# EAGLE design myradio (EAGLE 5.10)
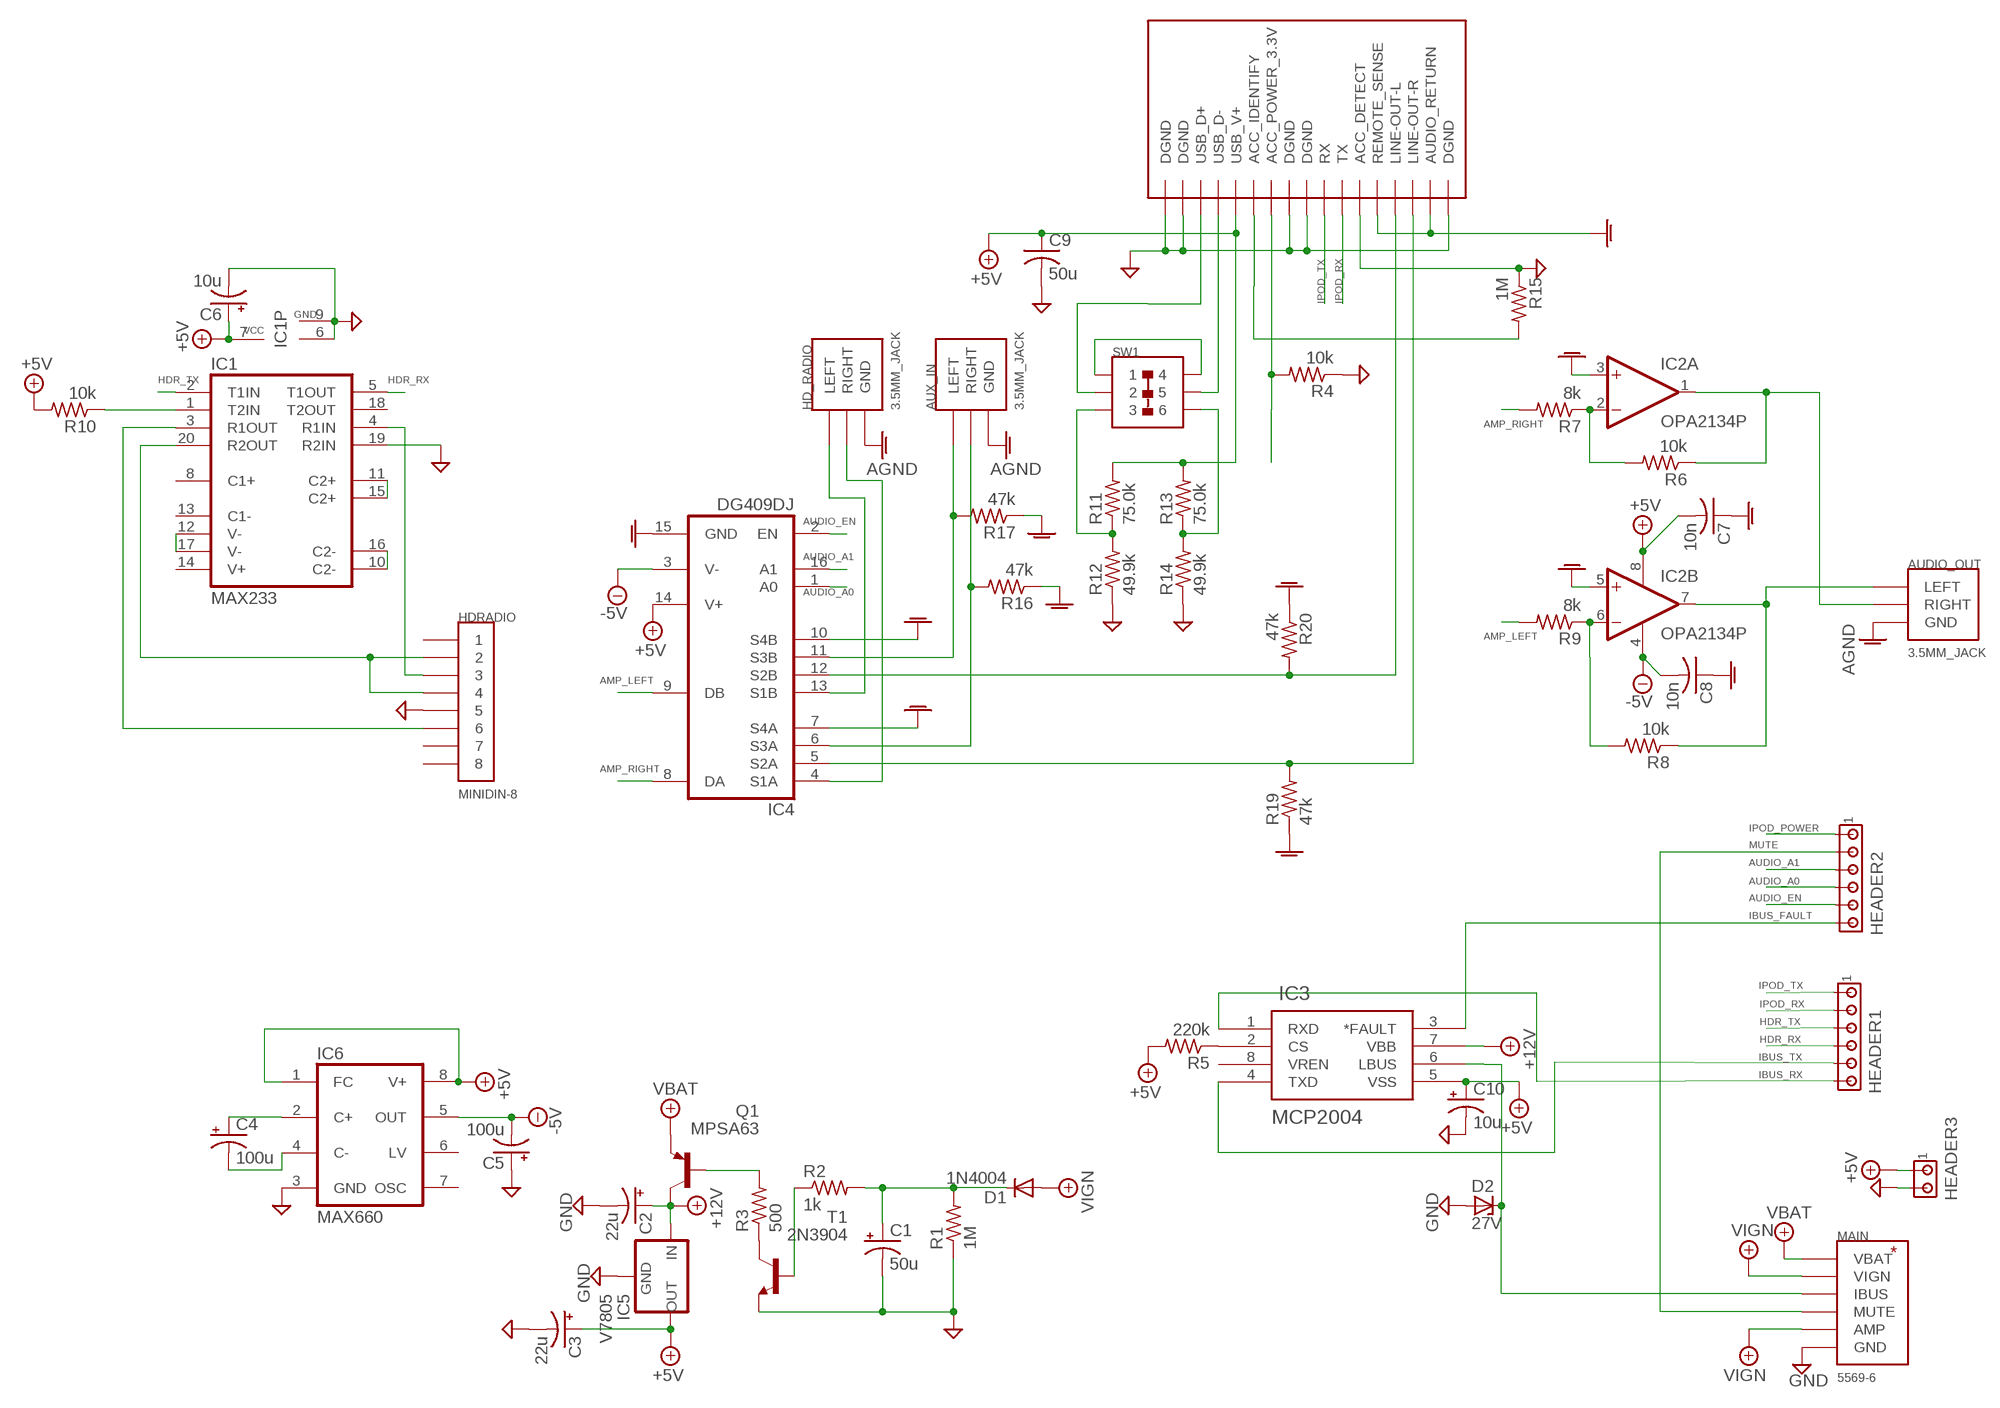
[diagram p0: schematic, sheet 1]

## Parts
AUDIO_OUT  3.5MM_JACK  [3.5MM_JACK]
AUX_IN  3.5MM_JACK  [3.5MM_JACK]
C1  50u  CPOL-USE2-5  [E2-5]
C2  22u  CPOL-USE2-5  [E2-5]
C3  22u  CPOL-USE2-5  [E2-5]
C4  100u  CPOL-USE2-5  [E2-5]
C5  100u  CPOL-USE2-5  [E2-5]
C6  10u  CPOL-USE2-5  [E2-5]
C7  10n  C-US025-050X050  [C025-050X050]
C8  10n  C-US025-050X050  [C025-050X050]
C9  50u  C-US025-050X050  [C025-050X050]
C10  10u  CPOL-USE2-5  [E2-5]
CON1  IPOD_CONNECTOR  [IPOD_EDGE_BIGPAD]
D1  1N4004  [DO41-10]
D2  27V  ZENER-DIODEZD-10  [ZDIO-10]
HD_RADIO  3.5MM_JACK  [3.5MM_JACK]
HDRADIO  MINIDIN-8  [MINIDIN-8]
HEADER1  MTA06-100  [10X06MTA]
HEADER2  MTA06-100  [10X06MTA]
HEADER3  MTA02-100  [10X02MTA]
IC1  MAX233  [DIL20]
IC2  OPA2134P  [DIL08]
IC3  MCP2004  [SOCKET-08]
IC4  DG409DJ  [DIL16]
IC5  V7805  V7805-1000R  [78XXL]
IC6  MAX660  MAX660CPA  [DIL08]
MAIN  5569-6  [5569-6]
Q1  MPSA63  [TO92-CBE]
R1  1M  R-US_0207/10  [0207/10]
R2  1k  R-US_0207/10  [0207/10]
R3  500  R-US_0207/10  [0207/10]
R4  10k  R-US_0207/10  [0207/10]
R5  220k  R-US_0207/10  [0207/10]
R6  10k  R-US_0207/10  [0207/10]
R7  8k  R-US_0207/10  [0207/10]
R8  10k  R-US_0207/10  [0207/10]
R9  8k  R-US_0207/10  [0207/10]
R10  10k  R-US_0207/10  [0207/10]
R11  75.0k  R-US_0207/10  [0207/10]
R12  49.9k  R-US_0207/10  [0207/10]
R13  75.0k  R-US_0207/10  [0207/10]
R14  49.9k  R-US_0207/10  [0207/10]
R15  1M  R-US_0207/10  [0207/10]
R16  47k  R-US_0207/10  [0207/10]
R17  47k  R-US_0207/10  [0207/10]
R19  47k  R-US_0207/10  [0207/10]
R20  47k  R-US_0207/10  [0207/10]
SW1  DPDT-SWITCH  [DPDT-SWITCH]
T1  2N3904  2N3904-NPN-TO92-EBC  [TO92-EBC]

## Nets
+5V [power]: C3.+ C6.+ C7.2 C9.1 C10.+ CON1.P$8(USB_V+) HEADER3.1 IC1.7(VCC) IC2.8(P:V+) IC3.5(VSS) IC4.14(V+) IC5.OUT IC6.1(FC) IC6.8(V+) R5.2 R10.2 R11.2 R13.2
+12V [power]: C2.+ IC3.7(VBB) IC5.IN Q1.C
-5V [power]: C5.- C8.2 IC2.4(P:V-) IC4.3(V-) IC6.5(OUT)
AGND: AUDIO_OUT.1(GND) AUX_IN.1(GND) C7.1 C8.1 CON1.P$24(REMOTE_SENSE) CON1.P$29(AUDIO_RETURN) HD_RADIO.1(GND) IC2.3(A:+IN) IC2.5(B:+IN) IC4.7(S4A) IC4.10(S4B) IC4.15(GND) R16.1 R17.1 R19.1 R20.1
AMP_LEFT: IC4.9(DB) R9.2
AMP_RIGHT: IC4.8(DA) R7.2
AUDIO_A0: HEADER2.3 IC4.1(A0)
AUDIO_A1: HEADER2.4 IC4.16(A1)
AUDIO_EN: HEADER2.2 IC4.2(EN)
AUDIO_OUT_L: AUDIO_OUT.2(LEFT) IC2.7(B:OUT) R8.1
AUDIO_OUT_R: AUDIO_OUT.3(RIGHT) IC2.1(A:OUT) R6.1
AUX_LEFT: AUX_IN.2(LEFT) IC4.11(S3B) R17.2
AUX_RIGHT: AUX_IN.3(RIGHT) IC4.6(S3A) R16.2
GND [power]: C1.- C2.- C3.- C5.+ C6.- C9.2 C10.- CON1.P$1(DGND) CON1.P$2(DGND) CON1.P$15(DGND) CON1.P$16(DGND) CON1.P$20(ACC_DETECT) CON1.P$30(DGND) D2.A HDRADIO.5 HEADER3.2 IC1.6(GND) IC1.9(GND) IC1.19(R2IN) IC5.GND IC6.3(GND) MAIN.6(GND) R1.1 R4.1 R12.1 R14.1 R15.1 T1.E
HDR_LEFT: HD_RADIO.2(LEFT) IC4.13(S1B)
HDR_RIGHT: HD_RADIO.3(RIGHT) IC4.4(S1A)
HDR_RX: HEADER1.3 IC1.5(T1OUT)
HDR_TX: HEADER1.4 IC1.2(T1IN)
IBUS: D2.C IC3.6(LBUS) MAIN.3(IBUS)
IBUS_FAULT: HEADER2.1 IC3.3(*FAULT)
IBUS_RX: HEADER1.1 IC3.1(RXD)
IBUS_TX: HEADER1.2 IC3.4(TXD)
IPOD_LEFT: CON1.P$27(LINE-OUT-L) IC4.12(S2B) R20.2
IPOD_POWER: CON1.P$13(ACC_POWER_3.3V) HEADER2.6 R4.2
IPOD_RIGHT: CON1.P$28(LINE-OUT-R) IC4.5(S2A) R19.2
IPOD_RX: CON1.P$19(TX) HEADER1.5
IPOD_TX: CON1.P$18(RX) HEADER1.6
MUTE: HEADER2.5 MAIN.4(MUTE)
N$2: HDRADIO.6 IC1.3(R1OUT)
N$3: C1.+ D1.C R1.2 R2.2
N$4: R2.1 T1.B
N$5: Q1.B R3.2
N$6: R3.1 T1.C
N$12: C4.+ IC6.2(C+)
N$13: IC2.2(A:-IN) R6.2 R7.1
N$14: C4.- IC6.4(C-)
N$16: HDRADIO.3 IC1.4(R1IN)
N$18: HDRADIO.2 HDRADIO.4 IC1.20(R2OUT)
N$19: IC1.12(V-) IC1.17(V-)
N$20: IC1.10(C2-) IC1.16(C2-)
N$21: IC1.11(C2+) IC1.15(C2+)
N$22: IC3.2(CS) R5.1
N$23: IC2.6(B:-IN) R8.2 R9.1
N$24: IC1.1(T2IN) R10.1
N$26: R11.1 R12.2 SW1.3
N$27: CON1.P$10(ACC_IDENTIFY) R15.2
N$29: CON1.P$4(USB_D+) SW1.2
N$31: CON1.P$6(USB_D-) SW1.5
N$32: SW1.1 SW1.4
N$33: R13.1 R14.2 SW1.6
VBAT [power]: MAIN.1(VBAT) Q1.E
VIGN: D1.A MAIN.2(VIGN) MAIN.5(AMP)
Unconnected: HDRADIO.1 HDRADIO.7 HDRADIO.8 IC1.8(C1+) IC1.13(C1-) IC1.14(V+) IC1.18(T2OUT) IC3.8(VREN) IC6.6(LV) IC6.7(OSC)

## Library data of the parts
AUDIO_OUT AUX_IN HD_RADIO = myradio:3.5MM_JACK: 3.5mm Audio Jack STX-3150-3N
C1-C6 C10 = rcl:CPOL-US: POLARIZED CAPACITOR, American symbol
C7-C9 = rcl:C-US: CAPACITOR, American symbol
CON1 = myradio:IPOD_CONNECTOR: male ipod edge connector from Ridax
D1 = diode:1N4004: DIODE general purpose rectifier, 1 A
D2 = diode:ZENER-DIODE: Z-Diode
HDRADIO = myradio:MINIDIN-8: MINI-DIN 8 Pin Connector KMDLX-8S-BS
HEADER1 HEADER2 = con-amp:MTA06-100: AMP connector
HEADER3 = con-amp:MTA02-100: AMP connector
IC1 = maxim:MAX233: RS232 TRANSEIVER
IC2 = linear:OPA2134: SoundPLUS (TM) High Performance AUDIO OPERATIONAL AMPLIFIERS Source: http://focus.ti.com/lit/ds/sbos058/sbos058.pdf
IC3 = myradio:MCP2004: LIN Bus Transceiver
IC4 = maxim:DG409DJ: ANALOG MULTIPLEXER
IC5 = myradio:V7805-1000R: Switched 5V Regulator
IC6 = maxim:MAX660CPA: Charge-pump VOLTAGE CONVERTER
MAIN = myradio:5569-6: Main Board I/O Connector Molex 5569-6
Q1 = transistor-pnp:MPSA63*: PNP Transistror
R1-R17 R19 R20 = rcl:R-US_: RESISTOR, American symbol
SW1 = myradio:DPDT-SWITCH: mini DPDT slide switch CKN9545-ND
T1 = transistor-neu-to92:*-NPN-: NPN Transistror

## Net classes
1 power: width 0.508 mm, clearance 0.254 mm

## Board
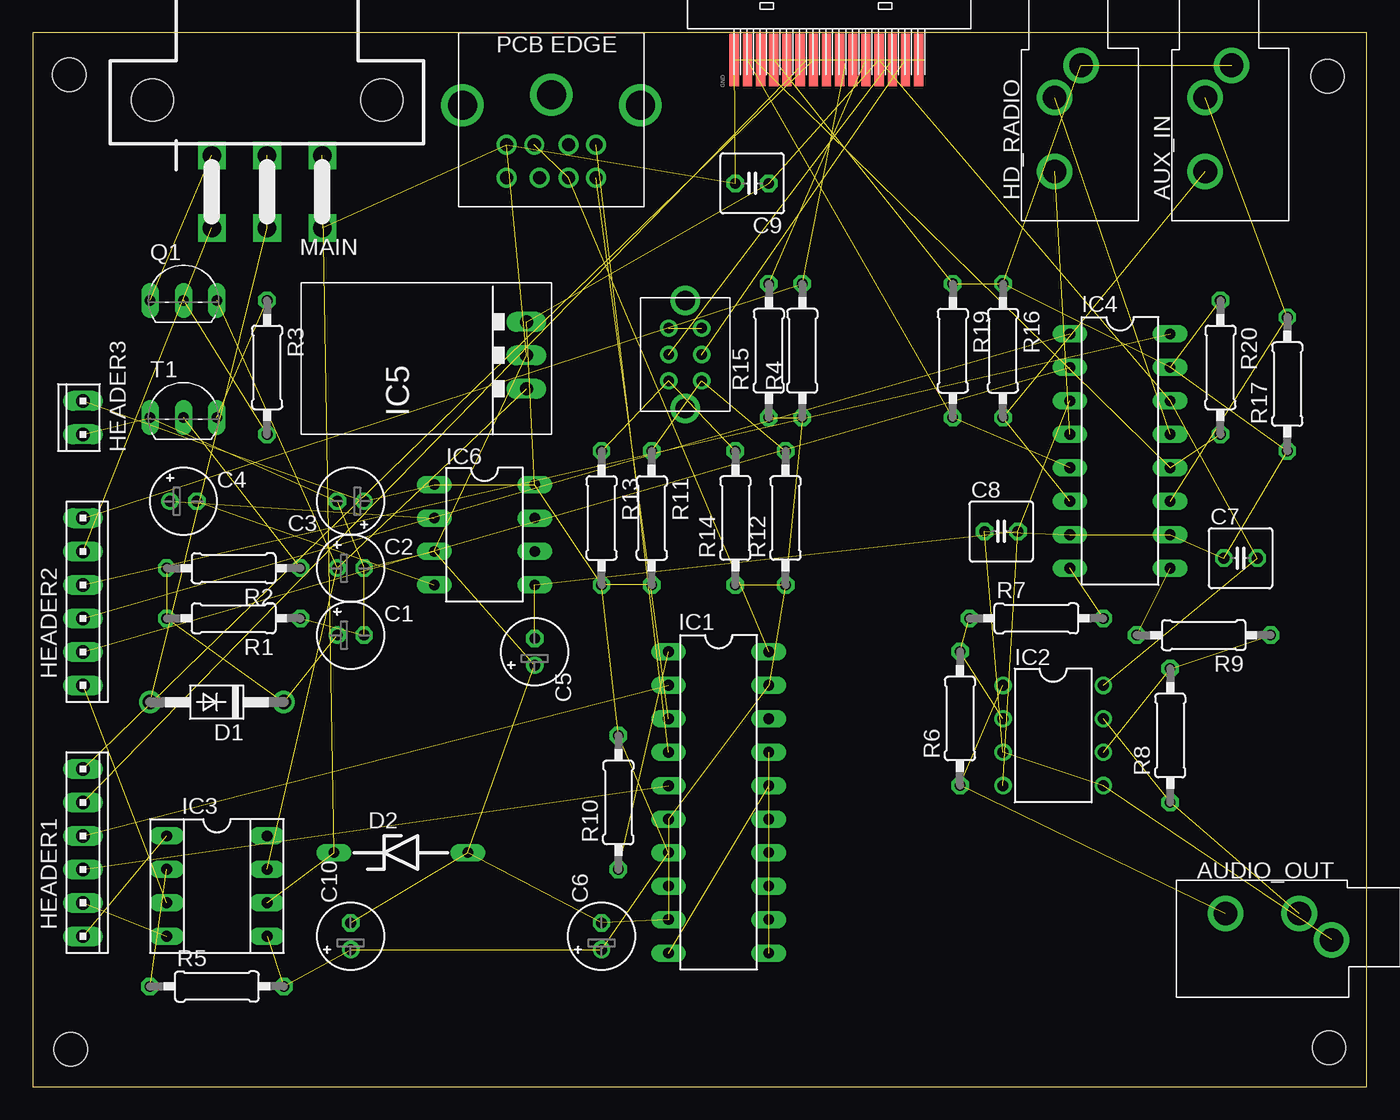
[diagram p1: board, top side]
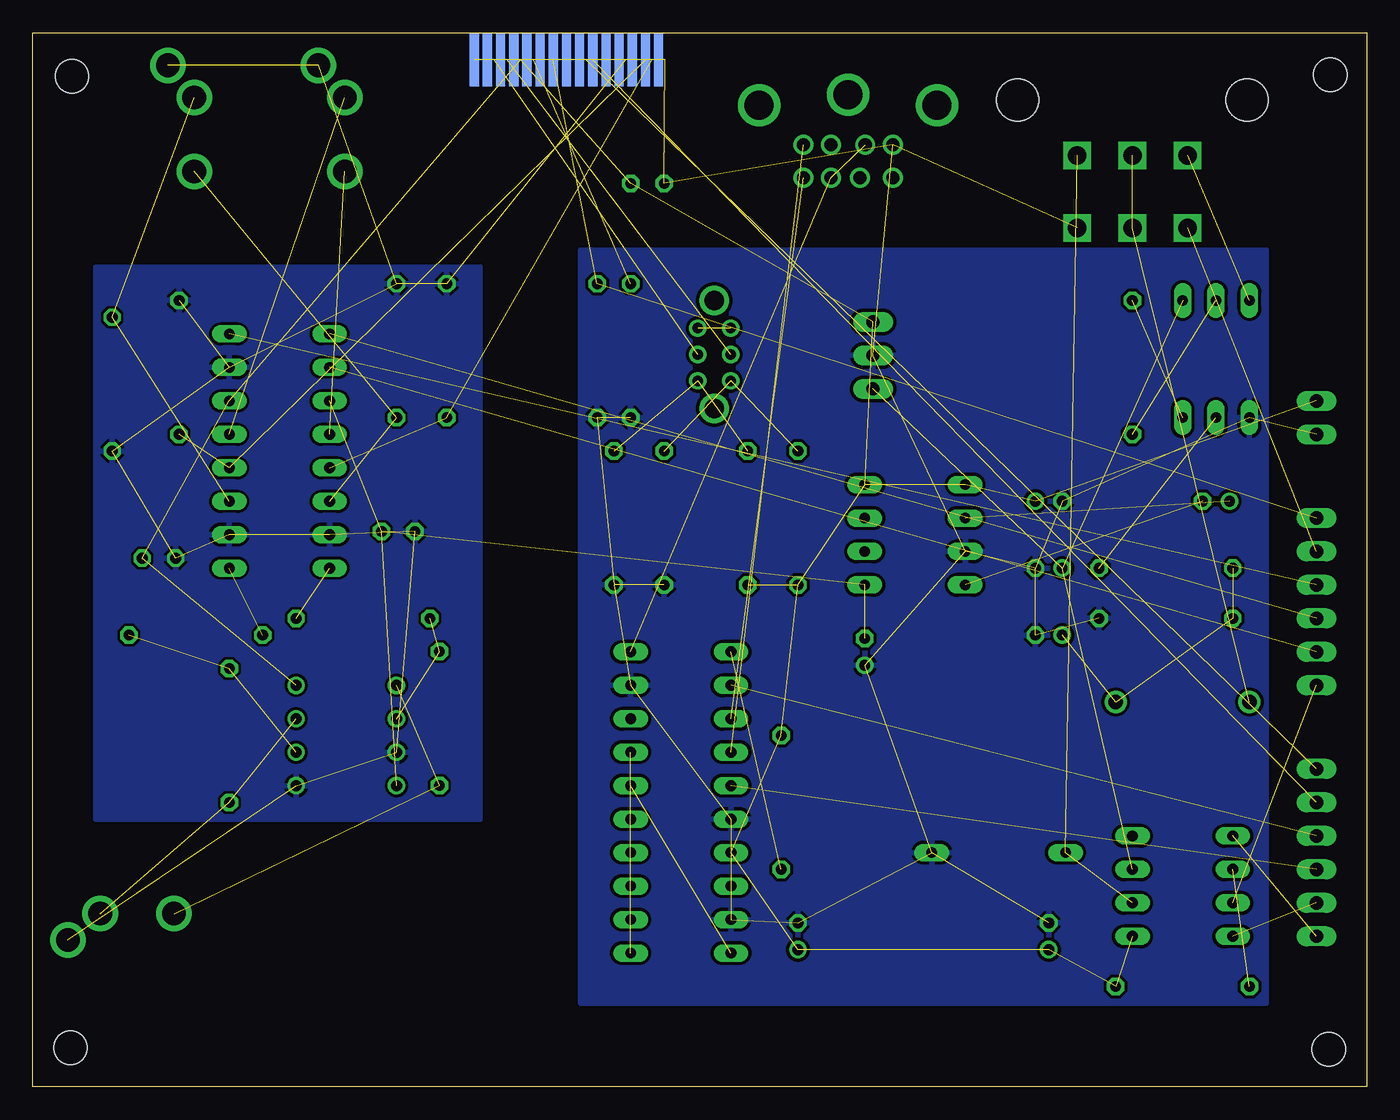
[diagram p2: board, bottom side, seen from below]

Size 101.27 x 80 mm. Coordinates in mm from the lower left corner, seen from the top.
Outline: 0,0 101.27,0 101.27,80 0,80 0,0
Copper layers (1*16): Top 0.035mm / dielectric 1.5mm / Bottom 0.035mm
Design rules "default *": minimum track width 10mil, minimum drill 24mil, track to track 8mil, track to pad 8mil, pad to pad 8mil, via to via 8mil, smd to smd 8mil, copper to edge 40mil, drill to drill 8mil, minimum pad ring 10mil, minimum via ring 8mil, stop-mask expansion 4mil, vias tented up to drill 0mil, thermal gap 10mil
Holes 2.54 mm at 2.86,2.86 98.42,2.97 98.31,76.72 2.75,76.82

### Footprints (pad centres in the part's own frame; a part is rotated, then mirrored left to right if it is on the bottom)
3.5MM_JACK = drill 1.8 round: 1 -1.2,-0.85; 2 -3.65,1.15; 3 -9.25,1.15
E2-5 = drill 0.813 pad 1.27 round: + -1.016,0 | drill 0.813 pad 1.27 octagon: - 1.016,0
C025-050X050 = drill 0.813 octagon: 1 -1.27,0; 2 1.27,0
IPOD_EDGE_BIGPAD = smd 0.7 x 4 bottom: P$1 7.54,0.15; P$3 6.54,0.15; P$5 5.54,0.15; P$7 4.54,0.15; P$9 3.54,0.15; P$11 2.54,0.15; P$13 1.54,0.15; P$15 0.54,0.15; P$17 -0.46,0.15; P$19 -1.46,0.15; P$21 -2.46,0.15; P$23 -3.46,0.15; P$25 -4.46,0.15; P$27 -5.46,0.15; P$29 -6.46,0.15 | smd 0.7 x 4: P$2 7.04,0.15; P$4 6.04,0.15; P$6 5.04,0.15; P$8 4.04,0.15; P$10 3.04,0.15; P$12 2.04,0.15; P$14 1.04,0.15; P$16 0.04,0.15; P$18 -0.96,0.15; P$20 -1.96,0.15; P$22 -2.96,0.15; P$24 -3.96,0.15; P$26 -4.96,0.15; P$28 -5.96,0.15; P$30 -6.96,0.15
DO41-10 = drill 1.118 round: A 5.08,0; C -5.08,0
ZDIO-10 = drill 0.813 long: A 5.08,0; C -5.08,0
MINIDIN-8 = drill 1 round: 1 1.3,-8.5; 2 -1.3,-8.5; 3 3.4,-8.5; 4 1.3,-11; 5 -3.4,-8.5; 6 3.4,-11; 7 -0.9,-11; 8 -3.4,-11 | drill 2.2 round: P$1 0,-4.7; P$2 6.75,-5.5; P$3 -6.75,-5.5
10X06MTA = drill 1.016 long: 1 6.35,0; 2 3.81,0; 3 1.27,0; 4 -1.27,0; 5 -3.81,0; 6 -6.35,0
10X02MTA = drill 1.016 long: 1 1.27,0; 2 -1.27,0
DIL20 = drill 0.813 long: 1 -11.43,-3.81; 2 -8.89,-3.81; 3 -6.35,-3.81; 4 -3.81,-3.81; 5 -1.27,-3.81; 6 1.27,-3.81; 7 3.81,-3.81; 8 6.35,-3.81; 9 8.89,-3.81; 10 11.43,-3.81; 11 11.43,3.81; 12 8.89,3.81; 13 6.35,3.81; 14 3.81,3.81; 15 1.27,3.81; 16 -1.27,3.81; 17 -3.81,3.81; 18 -6.35,3.81; 19 -8.89,3.81; 20 -11.43,3.81
DIL08 = drill 0.813 pad 1.27 round: 1 -3.81,-3.81; 2 -1.27,-3.81; 3 1.27,-3.81; 4 3.81,-3.81; 5 3.81,3.81; 6 1.27,3.81; 7 -1.27,3.81; 8 -3.81,3.81
SOCKET-08 = drill 0.813 long: 1 -3.81,-3.81; 2 -1.27,-3.81; 3 1.27,-3.81; 4 3.81,-3.81; 5 3.81,3.81; 6 1.27,3.81; 7 -1.27,3.81; 8 -3.81,3.81
DIL16 = drill 0.813 long: 1 -8.89,-3.81; 2 -6.35,-3.81; 3 -3.81,-3.81; 4 -1.27,-3.81; 5 1.27,-3.81; 6 3.81,-3.81; 7 6.35,-3.81; 8 8.89,-3.81; 9 8.89,3.81; 10 6.35,3.81; 11 3.81,3.81; 12 1.27,3.81; 13 -1.27,3.81; 14 -3.81,3.81; 15 -6.35,3.81; 16 -8.89,3.81
78XXL = drill 1.016 long: GND 6,1.89; IN 3.46,1.89; OUT 8.54,1.89
DIL08' = drill 0.813 long: 1 -3.81,-3.81; 2 -1.27,-3.81; 3 1.27,-3.81; 4 3.81,-3.81; 5 3.81,3.81; 6 1.27,3.81; 7 -1.27,3.81; 8 -3.81,3.81
5569-6 = drill 1.4 square: 1 4.2,0; 2 0,0; 3 -4.2,0; 4 4.2,5.5; 5 0,5.5; 6 -4.2,5.5 | hole 3.2: 8.7,-4.2; -8.7,-4.2
TO92-CBE = drill 0.813 long: B 0,0; C 2.54,0; E -2.54,0
0207/10 = drill 0.813 octagon: 1 -5.08,0; 2 5.08,0
DPDT-SWITCH = drill 0.8 round: 1 2.1,1.25; 2 4.1,1.25; 3 6.1,1.25; 4 2.1,-1.25; 5 4.1,-1.25; 6 6.1,-1.25 | drill 1.5 round: P$1 0,0; P$2 8.2,0
TO92-EBC = drill 0.813 long: B 0,-1.27; C 2.54,-1.27; E -2.54,-1.27

### Placement (x,y rotation side)
AUDIO_OUT  99.81,12 0 top
AUX_IN  90.17,78.74 90 top
C1  24.13,34.29 0 top
C2  24.13,39.37 0 top
C3  24.13,44.45 180 top
C4  11.43,44.45 0 top
C5  38.1,33.02 90 top
C6  43.18,11.43 90 top
C7  91.7,40.13 0 top
C8  73.53,42.16 0 top
C9  54.61,68.58 180 top
C10  24.13,11.43 90 top
CON1  60.22,77.81 0 top
D1  13.97,29.21 180 top
D2  27.94,17.78 0 top
HD_RADIO  78.74,78.74 90 top
HDRADIO  39.37,80.01 0 top
HEADER1  3.81,17.78 270 top
HEADER2  3.81,36.83 270 top
HEADER3  3.81,50.8 90 top
IC1  52.07,21.59 270 top
IC2  77.47,26.67 270 top
IC3  13.97,15.24 270 top
IC4  82.55,48.26 270 top
IC5  39.37,49.53 90 top
IC6  MAX660  [DIL08']  34.29,41.91 270 top
MAIN  17.78,70.7 180 top
Q1  11.43,59.69 0 top
R1  15.24,35.56 180 top
R2  15.24,39.37 180 top
R3  17.78,54.61 270 top
R4  58.42,55.88 90 top
R5  13.97,7.62 0 top
R6  70.4,27.96 90 top
R7  76.2,35.56 0 top
R8  86.36,26.67 90 top
R9  88.9,34.29 180 top
R10  44.45,21.59 90 top
R11  46.99,43.18 270 top
R12  57.15,43.18 90 top
R13  43.18,43.18 270 top
R14  53.34,43.18 90 top
R15  55.88,55.88 90 top
R16  73.66,55.88 270 top
R17  95.25,53.34 90 top
R19  69.85,55.88 270 top
R20  90.17,54.61 270 top
SW1  49.53,59.69 270 top
T1  11.43,52.07 0 top

### Tracks (layer width: path | path; a pad name or v marks a point on that pad's centre or on a via)
+5V  (17 unrouted)
+12V  (3 unrouted)
-5V  (4 unrouted)
AGND  (15 unrouted)
  pour Bottom: 67.31,62.23 96.52,62.23 96.52,20.32 67.31,20.32
AMP_LEFT  (1 unrouted)
AMP_RIGHT  (1 unrouted)
AUDIO_A0  (1 unrouted)
AUDIO_A1  (1 unrouted)
AUDIO_EN  (1 unrouted)
AUDIO_OUT_L  (2 unrouted)
AUDIO_OUT_R  (2 unrouted)
AUX_LEFT  (2 unrouted)
AUX_RIGHT  (2 unrouted)
GND  (27 unrouted)
  pour Bottom: 7.62,63.5 59.69,63.5 59.69,6.35 7.62,6.35
HDR_LEFT  (1 unrouted)
HDR_RIGHT  (1 unrouted)
HDR_RX  (1 unrouted)
HDR_TX  (1 unrouted)
IBUS  (2 unrouted)
IBUS_FAULT  (1 unrouted)
IBUS_RX  (1 unrouted)
IBUS_TX  (1 unrouted)
IPOD_LEFT  (2 unrouted)
IPOD_POWER  (2 unrouted)
IPOD_RIGHT  (2 unrouted)
IPOD_RX  (1 unrouted)
IPOD_TX  (1 unrouted)
MUTE  (1 unrouted)
N$2  (1 unrouted)
N$3  (3 unrouted)
N$4  (1 unrouted)
N$5  (1 unrouted)
N$6  (1 unrouted)
N$12  (1 unrouted)
N$13  (2 unrouted)
N$14  (1 unrouted)
N$16  (1 unrouted)
N$18  (2 unrouted)
N$19  (1 unrouted)
N$20  (1 unrouted)
N$21  (1 unrouted)
N$22  (1 unrouted)
N$23  (2 unrouted)
N$24  (1 unrouted)
N$26  (2 unrouted)
N$27  (1 unrouted)
N$29  (1 unrouted)
N$31  (1 unrouted)
N$32  (1 unrouted)
N$33  (2 unrouted)
VBAT  (1 unrouted)
VIGN  (2 unrouted)